# Altium schematic sheet CAN-INTERFACES.SchDoc: CAN Interfaces
size A3; Author: João Guimarães; Organization: Altium Limited; Address1: L3, 12a Rodborough Rd; Address2: Frenchs Forest; Address3: NSW; Address4: Australia 2086; Revision: 1.0; SheetNumber: 4; SheetTotal: 7
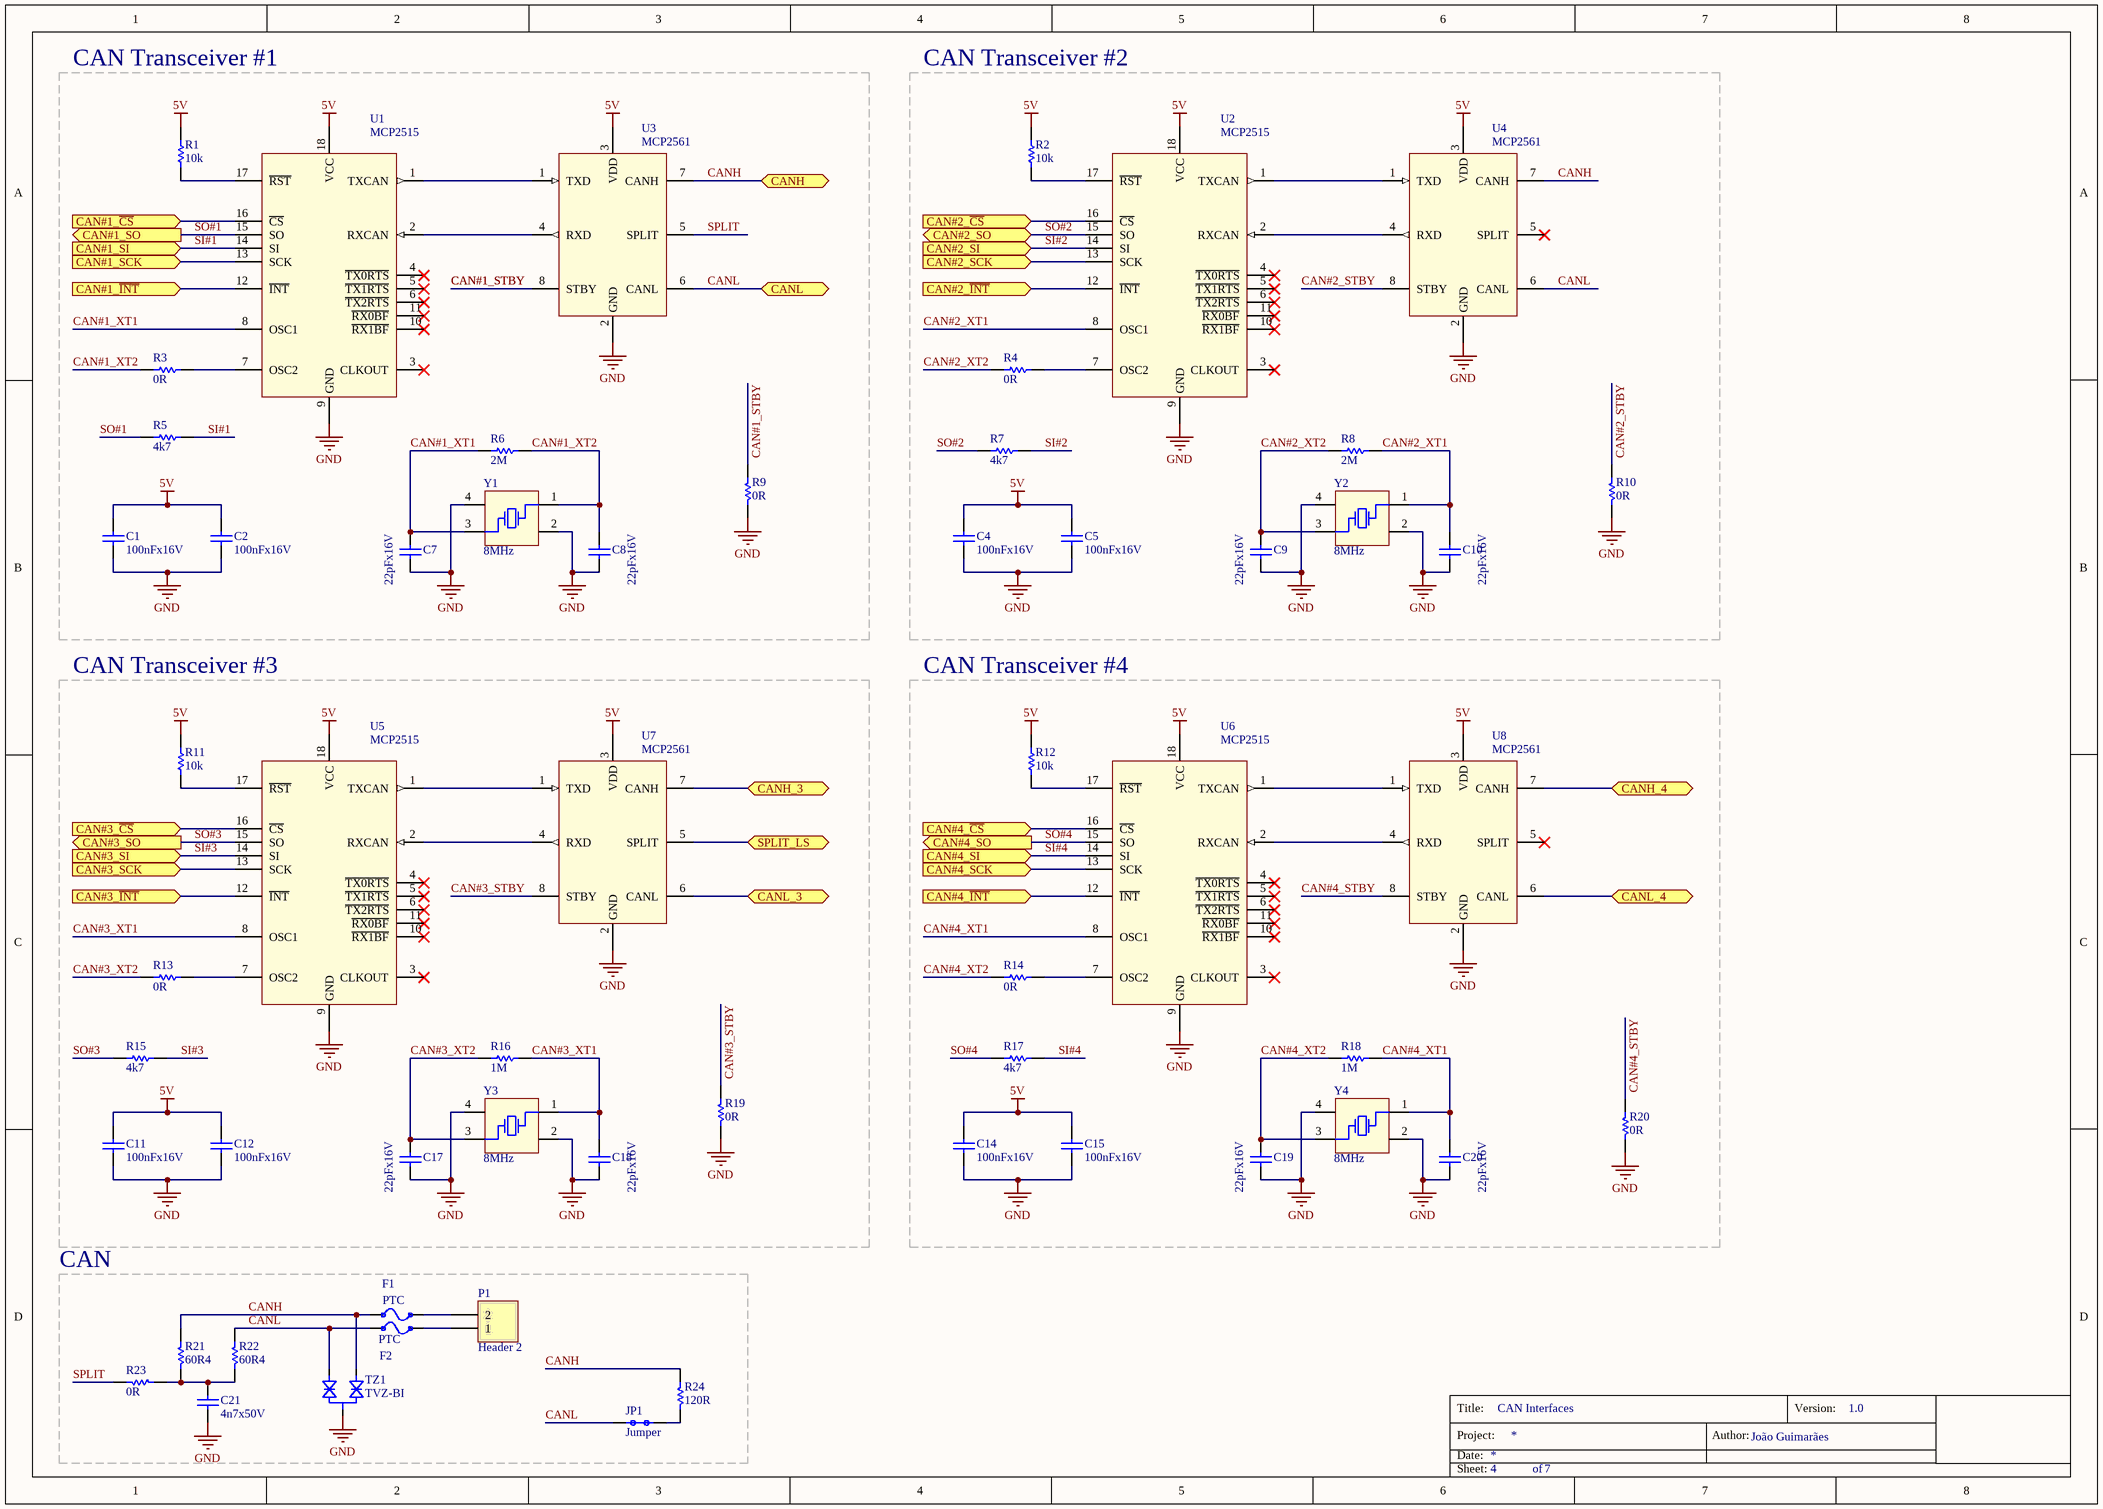
[diagram p0: CAN-INTERFACES.SchDoc]

## Parts
C1  100nFx16V  [DISC-0603]
C2  100nFx16V  [DISC-0603]
C4  100nFx16V  [DISC-0603]
C5  100nFx16V  [DISC-0603]
C7  22pFx16V  [DISC-0603]
C8  22pFx16V  [DISC-0603]
C9  22pFx16V  [DISC-0603]
C10  22pFx16V  [DISC-0603]
C11  100nFx16V  [DISC-0603]
C12  100nFx16V  [DISC-0603]
C14  100nFx16V  [DISC-0603]
C15  100nFx16V  [DISC-0603]
C17  22pFx16V  [DISC-0603]
C18  22pFx16V  [DISC-0603]
C19  22pFx16V  [DISC-0603]
C20  22pFx16V  [DISC-0603]
C21  4n7x50V  [DISC-0603]
F1  PTC  [DISC-FUSE-1206]
F2  PTC  [DISC-FUSE-1206]
JP1  Jumper  [CON-HEADER-1X2-PTH]
P1  Header 2  [CON-BORNE-2]
R1  10k  [DISC-0603]
R2  10k  [DISC-0603]
R3  0R  [DISC-0603]
R4  0R  [DISC-0603]
R5  4k7  [DISC-0603]
R6  2M  [DISC-0603]
R7  4k7  [DISC-0603]
R8  2M  [DISC-0603]
R9  0R  [DISC-0603]
R10  0R  [DISC-0603]
R11  10k  [DISC-0603]
R12  10k  [DISC-0603]
R13  0R  [DISC-0603]
R14  0R  [DISC-0603]
R15  4k7  [DISC-0603]
R16  1M  [DISC-0603]
R17  4k7  [DISC-0603]
R18  1M  [DISC-0603]
R19  0R  [DISC-0603]
R20  0R  [DISC-0603]
R21  60R4  [DISC-0805]
R22  60R4  [DISC-0805]
R23  0R  [DISC-0603]
R24  120R  [DISC-0805]
TZ1  TVZ-BI  [DISC-SOT-23]
U1  MCP2515  [CI-SOICW-18]
U2  MCP2515  [CI-SOICW-18]
U3  MCP2561  [CI-SOIC-8]
U4  MCP2561  [CI-SOIC-8]
U5  MCP2515  [CI-SOICW-18]
U6  MCP2515  [CI-SOICW-18]
U7  MCP2561  [CI-SOIC-8]
U8  MCP2561  [CI-SOIC-8]
Y1  8MHz  [DISC-CRYSTAL-4P-3.2X2.5]
Y2  8MHz  [DISC-CRYSTAL-4P-3.2X2.5]
Y3  8MHz  [DISC-CRYSTAL-4P-3.2X2.5]
Y4  8MHz  [DISC-CRYSTAL-4P-3.2X2.5]

## Blocks framed on the sheet
CAN Transceiver #1: C1 C2 C7 C8 R1 R3 R5 R6 R9 U1 U3 Y1
CAN Transceiver #2: C4 C5 C9 C10 R2 R4 R7 R8 R10 U2 U4 Y2
CAN Transceiver #3: C11 C12 C17 C18 R11 R13 R15 R16 R19 U5 U7 Y3
CAN Transceiver #4: C14 C15 C19 C20 R12 R14 R17 R18 R20 U6 U8 Y4
CAN: C21 F1 F2 JP1 P1 R21-R24 TZ1

## Ports
CAN#1_SCK (in), CAN#1_SI (in), CAN#1_SO (out), CAN#1_~{CS} (in), CAN#1_~{INT} (in), CAN#2_SCK (in), CAN#2_SI (in), CAN#2_SO (bidir), CAN#2_~{CS} (in), CAN#2_~{INT} (in), CAN#3_SCK (in), CAN#3_SI (in), CAN#3_SO (out), CAN#3_~{CS} (in), CAN#3_~{INT} (in), CAN#4_SCK (in), CAN#4_SI (in), CAN#4_SO (out), CAN#4_~{CS} (in), CAN#4_~{INT} (in), CANH (bidir), CANH_3 (bidir), CANH_4 (bidir), CANL (bidir), CANL_3 (bidir), CANL_4 (bidir), SPLIT_LS (bidir)

## Nets
5V: C1.1 C2.1 C4.1 C5.1 C11.1 C12.1 C14.1 C15.1 R1.1 R2.1 R11.1 R12.1 U1.18(VCC) U2.18(VCC) U3.3(VDD) U4.3(VDD) U5.18(VCC) U6.18(VCC) U7.3(VDD) U8.3(VDD)
GND: C1.2 C2.2 C4.2 C5.2 C7.1 C8.1 C9.1 C10.1 C11.2 C12.2 C14.2 C15.2 C17.1 C18.1 C19.1 C20.1 C21.1 R9.1 R10.1 R19.1 R20.1 TZ1.2(K) U1.9(GND) U2.9(GND) U3.2(GND) U4.2(GND) U5.9(GND) U6.9(GND) U7.2(GND) U8.2(GND) Y1.2(GND) Y1.4(GND) Y2.2(GND) Y2.4(GND) Y3.2(GND) Y3.4(GND) Y4.2(GND) Y4.4(GND)
CAN#1_~{CS}: U1.16(~{CS}) ; port CAN#1_~{CS}
CAN#1_~{INT}: U1.12(~{INT}) ; port CAN#1_~{INT}
CAN#1_SCK: U1.13(SCK) ; port CAN#1_SCK
CAN#1_STBY: R9.2 U3.8(STBY)
CAN#1_XT1: C7.2 R6.1 U1.8(OSC1) Y1.3(OSC2)
CAN#1_XT2: C8.2 R3.2 R6.2 Y1.1(OSC1)
CAN#2_~{CS}: U2.16(~{CS}) ; port CAN#2_~{CS}
CAN#2_~{INT}: U2.12(~{INT}) ; port CAN#2_~{INT}
CAN#2_SCK: U2.13(SCK) ; port CAN#2_SCK
CAN#2_STBY: R10.2 U4.8(STBY)
CAN#2_XT1: C10.2 R8.2 U2.8(OSC1) Y2.1(OSC1)
CAN#2_XT2: C9.2 R4.2 R8.1 Y2.3(OSC2)
CAN#3_~{CS}: U5.16(~{CS}) ; port CAN#3_~{CS}
CAN#3_~{INT}: U5.12(~{INT}) ; port CAN#3_~{INT}
CAN#3_SCK: U5.13(SCK) ; port CAN#3_SCK
CAN#3_STBY: R19.2 U7.8(STBY)
CAN#3_XT1: C18.2 R16.2 U5.8(OSC1) Y3.1(OSC1)
CAN#3_XT2: C17.2 R13.2 R16.1 Y3.3(OSC2)
CAN#4_~{CS}: U6.16(~{CS}) ; port CAN#4_~{CS}
CAN#4_~{INT}: U6.12(~{INT}) ; port CAN#4_~{INT}
CAN#4_SCK: U6.13(SCK) ; port CAN#4_SCK
CAN#4_STBY: R20.2 U8.8(STBY)
CAN#4_XT1: C20.2 R18.2 U6.8(OSC1) Y4.1(OSC1)
CAN#4_XT2: C19.2 R14.2 R18.1 Y4.3(OSC2)
CANH: F1.1 R21.2 R24.1 TZ1.3(A2) U3.7(CANH) U4.7(CANH) ; port CANH
CANH_3: U7.7(CANH) ; port CANH_3
CANH_4: U8.7(CANH) ; port CANH_4
CANL: F2.1 JP1.1 R22.2 TZ1.1(A1) U3.6(CANL) U4.6(CANL) ; port CANL
CANL_3: U7.6(CANL) ; port CANL_3
CANL_4: U8.6(CANL) ; port CANL_4
SI#1: R5.1 U1.14(SI) ; port CAN#1_SI
SI#2: R7.1 U2.14(SI) ; port CAN#2_SI
SI#3: R15.1 U5.14(SI) ; port CAN#3_SI
SI#4: R17.1 U6.14(SI) ; port CAN#4_SI
SO#1: R5.2 U1.15(SO) ; port CAN#1_SO
SO#2: R7.2 U2.15(SO) ; port CAN#2_SO
SO#3: R15.2 U5.15(SO) ; port CAN#3_SO
SO#4: R17.2 U6.15(SO) ; port CAN#4_SO
SPLIT: R23.1 U3.5(SPLIT)
SPLIT_LS: U7.5(SPLIT) ; port SPLIT_LS
NetC21_2: C21.2 R21.1 R22.1 R23.2
NetF1_2: F1.2 P1.2
NetF2_2: F2.2 P1.1
NetJP1_2: JP1.2 R24.2
NetR1_2: R1.2 U1.17(~{RST})
NetR2_2: R2.2 U2.17(~{RST})
NetR3_1: R3.1 U1.7(OSC2)
NetR4_1: R4.1 U2.7(OSC2)
NetR11_2: R11.2 U5.17(~{RST})
NetR12_2: R12.2 U6.17(~{RST})
NetR13_1: R13.1 U5.7(OSC2)
NetR14_1: R14.1 U6.7(OSC2)
NetU1_1: U1.1(TXCAN) U3.1(TXD)
NetU1_2: U1.2(RXCAN) U3.4(RXD)
NetU2_1: U2.1(TXCAN) U4.1(TXD)
NetU2_2: U2.2(RXCAN) U4.4(RXD)
NetU5_1: U5.1(TXCAN) U7.1(TXD)
NetU5_2: U5.2(RXCAN) U7.4(RXD)
NetU6_1: U6.1(TXCAN) U8.1(TXD)
NetU6_2: U6.2(RXCAN) U8.4(RXD)

Not connected (* = marked no-connect by the designer): U1 3(CLKOUT)* 4(~{TX0RTS})* 5(~{TX1RTS})* 6(~{TX2RTS})* 10(~{RX1BF})* 11(~{RX0BF})*; U2 3(CLKOUT)* 4(~{TX0RTS})* 5(~{TX1RTS})* 6(~{TX2RTS})* 10(~{RX1BF})* 11(~{RX0BF})*; U4 5(SPLIT)*; U5 3(CLKOUT)* 4(~{TX0RTS})* 5(~{TX1RTS})* 6(~{TX2RTS})* 10(~{RX1BF})* 11(~{RX0BF})*; U6 3(CLKOUT)* 4(~{TX0RTS})* 5(~{TX1RTS})* 6(~{TX2RTS})* 10(~{RX1BF})* 11(~{RX0BF})*; U8 5(SPLIT)*

## Notes on the sheet
- Title:
- Project:
- Date:
- Author:
- Version:
- Sheet:
- of

## Library data of the parts
C1 C2 C4 C5 C7-C12 C14 C15 C17-C21 = Cap: Capacitor
F1 F2 = Fuse 2: Fuse; Published: 8-Jun-2000; LatestRevisionDate: 17-Jul-2002; LatestRevisionNote: Re-released for DXP Platform.; PackageReference: PIN-W2/E2.8; Publisher: Altium Limited; PackageDescription: Thru-Hole; 2 Leads
JP1 = Jumper: Resistor
P1 = Header 2: Header, 2-Pin; LatestRevisionDate: 17-Jul-2002; LatestRevisionNote: Re-released for DXP Platform.; Publisher: Altium Limited
R1-R20 R23 = Res: Resistor
R21 R22 = Res
R24 = Res: 60R4
TZ1 = TVZ-Bi-Dual: TVZ-Bi-Directional
U1 U2 U5 U6 = MCP2515: Stand-Alone CAN Controller With SPI Interface
U3 U4 U7 U8 = MCP2561: High speed CAN transceiver
Y1-Y4 = XTAL-4-PIN